# Altium schematic sheet Power.SchDoc
size A4
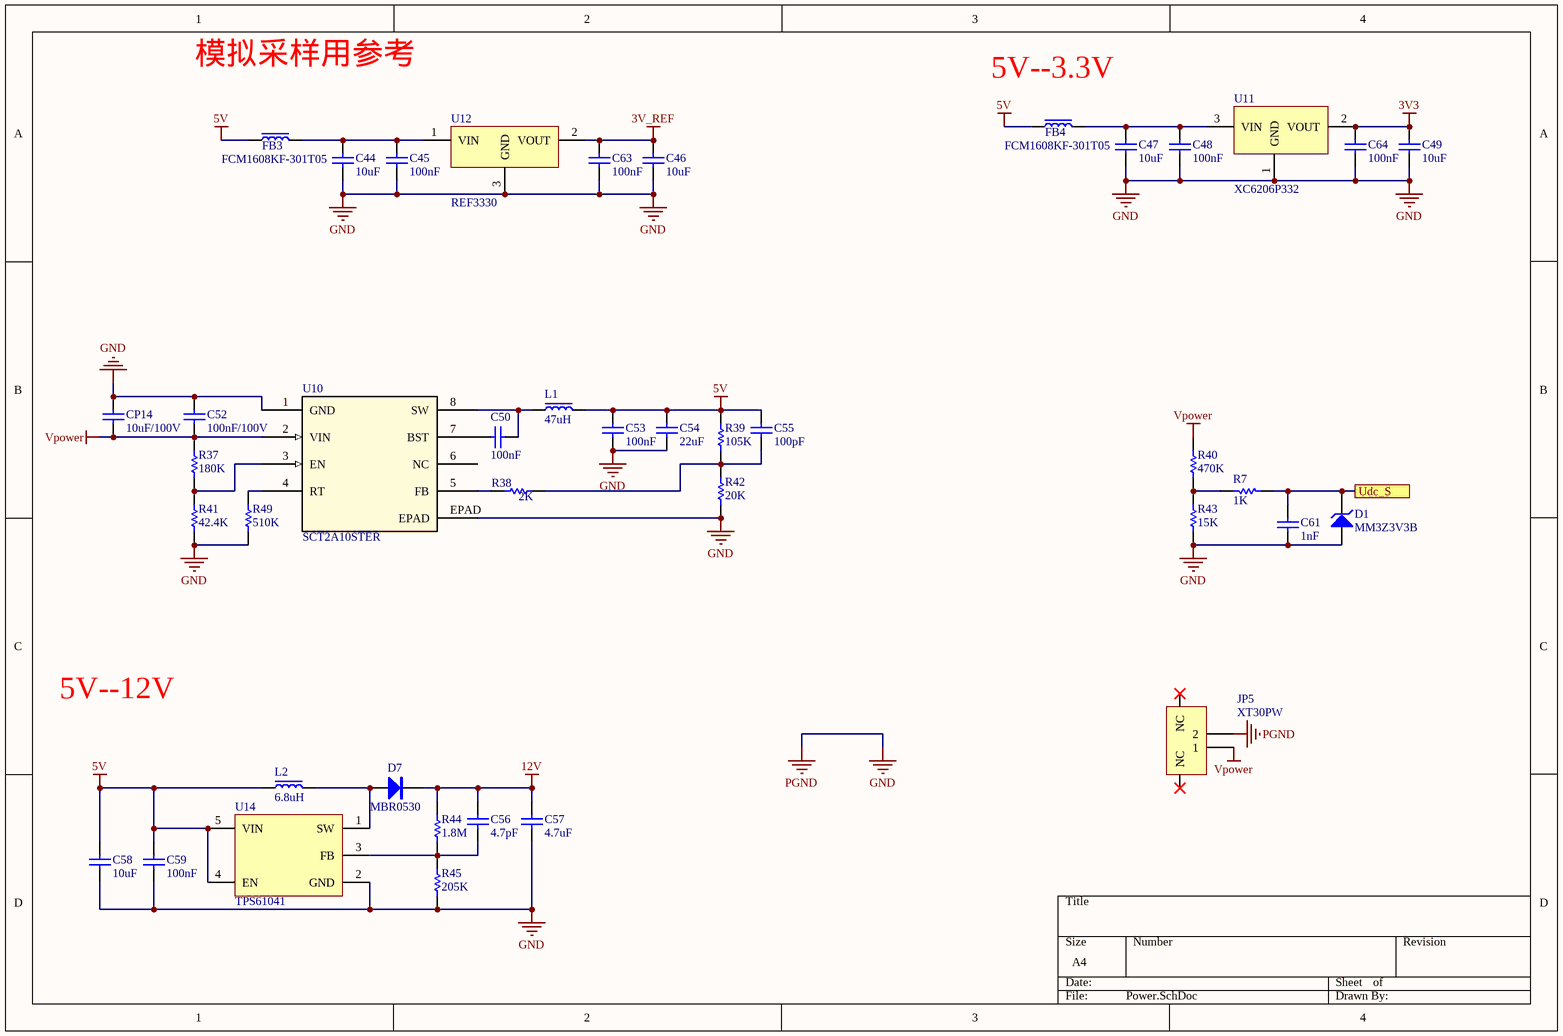
[diagram p0: Power.SchDoc]

## Parts
C44  10uF  [C0603]
C45  100nF  [C0603]
C46  10uF  [C0603]
C47  10uF  [C0603]
C48  100nF  [C0603]
C49  10uF  [C0603]
C50  100nF  [C0603]
C52  100nF/100V  [C0603]
C53  100nF  [C0603]
C54  22uF  [C0805]
C55  100pF  [C0603]
C56  4.7pF  [C0603]
C57  4.7uF  [C0805]
C58  10uF  [C0805]
C59  100nF  [C0603]
C61  1nF  [C0402]
C63  100nF  [C0603]
C64  100nF  [C0603]
CP14  10uF/100V  [C1206]
D1  MM3Z3V3B  [SOD-323]
D7  MBR0530  [SOD-123]
FB3  FCM1608KF-301T05  [FB 0402]
FB4  FCM1608KF-301T05  [FB 0402]
JP5  XT30PW  [XT30PW-M]
L1  47uH  [L 0630]
L2  6.8uH  [L 0530]
R7  1K  [R0402]
R37  180K  [R0603]
R38  2K  [R0603]
R39  105K  [R0603]
R40  470K  [R0402]
R41  42.4K  [R0603]
R42  20K  [R0603]
R43  15K  [R0402]
R44  1.8M  [R0603]
R45  205K  [R0603]
R49  510K  [R0603]
U10  SCT2A10STER  [DDA8_3P1X2P41-L]
U11  XC6206P332  [SOT23-3L]
U12  REF3330  [SOT23-3L]
U14  TPS61041  [SOT23-5L]

## Ports
Udc_S

## Nets
3V3: C49.2 C64.2 U11.2(VOUT)
3V_REF: C46.2 C63.2 U12.2(VOUT)
5V: C53.2 C54.1 C55.1 C58.2 C59.2 FB3.1 FB4.1 L1.2 L2.1 R39.2 U14.4(EN) U14.5(VIN)
12V: C56.2 C57.2 D7.K R44.1
GND: C44.1 C45.1 C46.1 C47.1 C48.1 C49.1 C52.1 C53.1 C54.2 C57.1 C58.1 C59.1 C61.2 C63.1 C64.1 CP14.1 D1.A JP5.2 R41.1 R42.1 R43.1 R45.2 R49.1 U10.1(GND) U10.EPAD U11.1(GND) U12.3(GND) U14.2(GND)  [also labelled PGND]
Vpower: C52.2 CP14.2 JP5.1 R37.2 R40.2 U10.2(VIN)
Udc_S: C61.1 D1.K R7.2 ; port Udc_S
NetC44_2: C44.2 C45.2 FB3.2 U12.1(VIN)
NetC47_2: C47.2 C48.2 FB4.2 U11.3(VIN)
NetC50_1: C50.1 U10.7(BST)
NetC50_2: C50.2 L1.1 U10.8(SW)
NetC55_2: C55.2 R38.1 R39.1 R42.2
NetC56_1: C56.1 R44.2 R45.1 U14.3(FB)
NetD7_A: D7.A L2.2 U14.1(SW)
NetR7_1: R7.1 R40.1 R43.2
NetR37_1: R37.1 R41.2 U10.3(EN)
NetR38_2: R38.2 U10.5(FB)
NetR49_2: R49.2 U10.4(RT)

Not connected (* = marked no-connect by the designer): JP5 3(NC)* 4(NC)*; U10 6(NC)

## Notes on the sheet
- 模拟采样用参考
- 5V--3.3V
- 5V--12V

## Library data of the parts
C44-C50 C52-C59 C61 C63 C64 CP14 = Cap
D1 = MM3Z3V3B: 3.14V~3.47V / 300mW
D7 = MBR0530: 30V 0.5A
FB3 FB4 = FB: 磁珠
L1 L2 = L-CDRH: 功率屏蔽电感
R7 R37-R45 R49 = RES
U10 = SCT2A10STER: No Description Available; Manufacturer_Part_Number: SCT2A10STER
U11 = XC6206: VIN < 6V
U12 = REF33XX: TI 电压基准
U14 = TPS6104x: Boost DC-DC